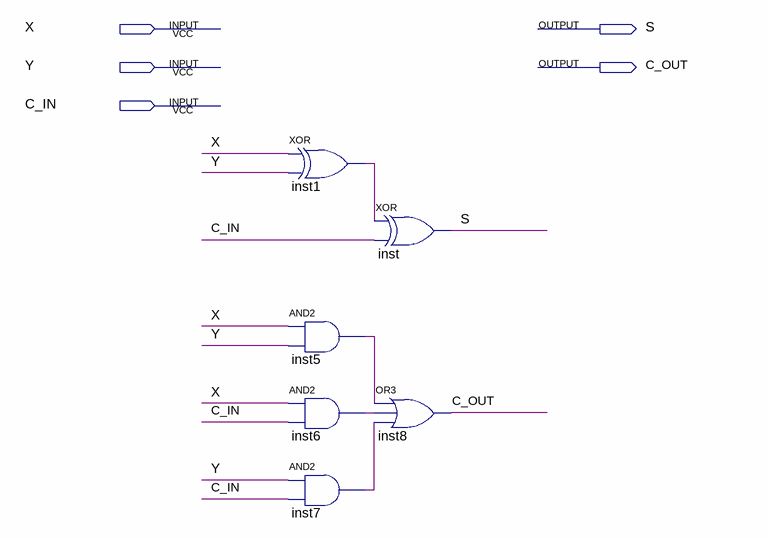
[diagram p0: schematic sheet]
// Quartus schematic F_Adder.bdf as structural Verilog: 6 symbols, 5 pins
module F_Adder (
  input  X,
  input  Y,
  input  C_IN,
  output S,
  output C_OUT
);

  wire inst1_out, inst5_out, inst6_out, inst7_out;

  xor inst1 (inst1_out, X, Y);
  and inst5 (inst5_out, X, Y);
  and inst6 (inst6_out, X, C_IN);
  and inst7 (inst7_out, Y, C_IN);
  xor inst (S, inst1_out, C_IN);
  or inst8 (C_OUT, inst5_out, inst6_out, inst7_out);
endmodule
